# Altium schematic sheet Sheet_1_2020-07-27_09-10-22.schdoc
size 313 x 206 mm
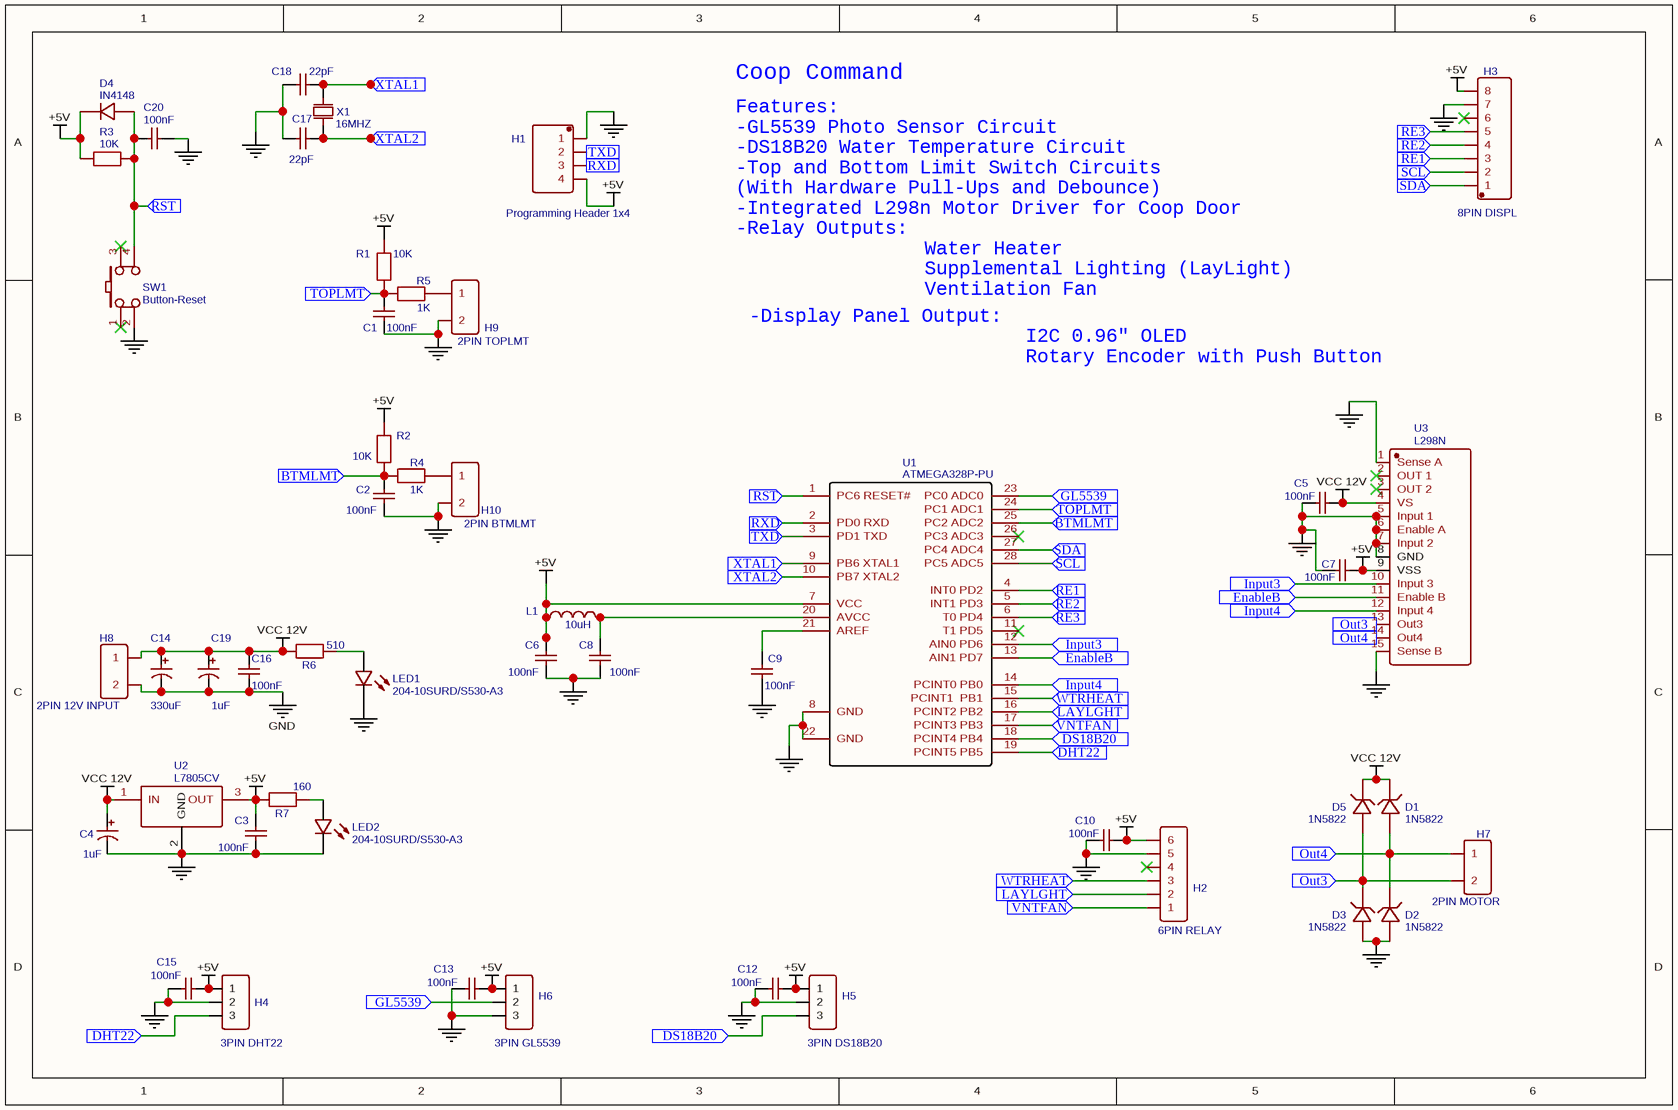
[diagram p0: Sheet_1_2020-07-27_09-10-22.schdoc]

## Parts
C1  100nF  [CAP-TH_L5.0-W2.5-P2.54-D0.7]
C2  100nF  [CAP-TH_L5.0-W2.5-P2.54-D0.7]
C3  100nF  [CAP-TH_L5.0-W2.5-P2.54-D0.7]
C4  1uF  [CAP-TH_BD4.0-P1.50-D0.8-FD]
C5  100nF  [CAP-TH_L5.0-W2.5-P2.54-D0.7]
C6  100nF  [CAP-TH_L5.0-W2.5-P2.54-D0.7]
C7  100nF  [CAP-TH_L5.0-W2.5-P2.54-D0.7]
C8  100nF  [CAP-TH_L5.0-W2.5-P2.54-D0.7]
C9  100nF  [CAP-TH_L5.0-W2.5-P2.54-D0.7]
C10  100nF  [CAP-TH_L5.0-W2.5-P2.54-D0.7]
C12  100nF  [CAP-TH_L5.0-W2.5-P2.54-D0.7]
C13  100nF  [CAP-TH_L5.0-W2.5-P2.54-D0.7]
C14  330uF  [CAP-TH_BD10.0-P5.00-D1.0-FD]
C15  100nF  [CAP-TH_L5.0-W2.5-P2.54-D0.7]
C16  100nF  [CAP-TH_L5.0-W2.5-P2.54-D0.7]
C17  22pF  [CAP-TH_L3.5-W3.0-P2.54-D0.8]
C18  22pF  [CAP-TH_L3.5-W3.0-P2.54-D0.8]
C19  1uF  [CAP-TH_BD4.0-P1.50-D0.8-FD]
C20  100nF  [CAP-TH_L5.0-W2.5-P2.54-D0.7]
D1  1N5822  [DO-27-BD3.5-L8.6-P12.6-D1.3-R-RD]
D2  1N5822  [DO-27-BD3.5-L8.6-P12.6-D1.3-R-RD]
D3  1N5822  [DO-27-BD3.5-L8.6-P12.6-D1.3-R-RD]
D4  IN4148  [DO-35_BD2.0-L4.2-P8.20-D0.5-RD]
D5  1N5822  [DO-27-BD3.5-L8.6-P12.6-D1.3-R-RD]
H1  Programming Header 1x4  [HDR-TH_4P-P2.54-V]
H2  6PIN RELAY  [HDR-TH_6P-P2.54-V]
H3  8PIN DISPL  [HDR-TH_8P-P2.54-V-M]
H4  3PIN DHT22  [HDR-TH_3P-P2.54-V]
H5  3PIN DS18B20  [HDR-TH_3P-P2.54-V]
H6  3PIN GL5539  [HDR-TH_3P-P2.54-V]
H7  2PIN MOTOR  [HDR-TH_2P-P2.54-V]
H8  2PIN 12V INPUT  [HDR-TH_2P-P2.54-V]
H9  2PIN TOPLMT  [HDR-TH_2P-P2.54-V]
H10  2PIN BTMLMT  [HDR-TH_2P-P2.54-V]
L1  10uH  [IND-TH_BD2.8-L7.0-P11.00-D0.5]
LED1  204-10SURD/S530-A3  [LED-TH_BD3.0-P2.54-FD]
LED2  204-10SURD/S530-A3  [LED-TH_BD3.0-P2.54-FD]
R1  10K  [RES-TH_BD2.4-L6.3-P10.30-D0.6]
R2  10K  [RES-TH_BD2.4-L6.3-P10.30-D0.6]
R3  10K  [RES-TH_BD2.4-L6.3-P10.30-D0.6]
R4  1K  [RES-TH_BD2.4-L6.3-P10.30-D0.6]
R5  1K  [RES-TH_BD2.4-L6.3-P10.30-D0.6]
R6  510  [RES-TH_BD2.4-L6.3-P10.30-D0.6]
R7  160  [RES-TH_BD2.4-L6.3-P10.30-D0.6]
SW1  Button-Reset  [SW-TH_4PIN-L6.00-W6.00]
U1  ATMEGA328P-PU  [DIP-28_L34.6-W7.3-P2.54-LS10.2-BL]
U2  L7805CV  [TO-220-3_L10.0-W4.5-P2.54-L]
U3  L298N  [MULTIWATT-15_L19.6-W5.0-P1.27-L]
X1  16MHZ  [HC-49S_L11.0-W4.4-P4.88]

## Ports
BTMLMT (in), DHT22 (in), DS18B20 (in), EnableB (in), GL5539 (in), Input3 (in), Input4 (in), LAYLGHT (in), Out3 (in), Out4 (in), RE1 (in), RE2 (in), RE3 (in), RST (in), RXD (in), SCL (in), SDA (in), TOPLMT (in), TXD (in), VNTFAN (in), WTRHEAT (in), XTAL1 (in), XTAL2 (in)

## Nets
+5V: C3.1 C6.1 C7.2 C10.2 C12.2 C13.2 C15.2 D4.1 H1.4 H2.6 H3.8 H4.1 H5.1 H6.1 L1.1 R1.2 R2.2 R3.2 R7.1 U1.7(VCC) U2.3(OUT) U3.9(VSS)
GND: C1.2 C2.2 C3.2 C4.2 C5.1 C6.2 C7.1 C8.2 C9.2 C10.1 C12.1 C13.1 C14.2 C15.1 C16.2 C17.1 C18.1 C19.2 C20.2 D2.2(A) D3.2(A) H1.1 H2.5 H3.7 H4.2 H5.2 H6.3 H8.2 H9.2 H10.2 LED1.2(K) LED2.2(K) SW1.2 U1.8(GND) U1.22(GND) U2.2(GND) U3.1(Sense_A) U3.5(Input_1) U3.6(Enable_A) U3.7(Input_2) U3.8(GND) U3.15(Sense_B)
VCC 12V: C4.1 C5.2 C14.1 C16.1 C19.1 D1.1(C) D5.1(C) H8.1 R6.1 U2.1(IN) U3.4(VS)
BTMLMT: C2.1 R2.1 R4.1 U1.25(PC2_ADC2) ; port BTMLMT
DHT22: H4.3 U1.19(PCINT5_PB5) ; port DHT22
DS18B20: H5.3 U1.18(PCINT4_PB4) ; port DS18B20
EnableB: U1.13(AIN1_PD7) U3.11(Enable_B) ; port EnableB
GL5539: H6.2 U1.23(PC0_ADC0) ; port GL5539
Input3: U1.12(AIN0_PD6) U3.10(Input_3) ; port Input3
Input4: U1.14(PCINT0_PB0) U3.12(Input_4) ; port Input4
LAYLGHT: H2.2 U1.16(PCINT2_PB2) ; port LAYLGHT
Out3: D3.1(C) D5.2(A) H7.2 U3.13(Out3) ; port Out3
Out4: D1.2(A) D2.1(C) H7.1 U3.14(Out4) ; port Out4
RE1: H3.3 U1.4(INT0_PD2) ; port RE1
RE2: H3.4 U1.5(INT1_PD3) ; port RE2
RE3: H3.5 U1.6(T0_PD4) ; port RE3
RST: C20.1 D4.2 R3.1 SW1.4 U1.1(PC6_RESET#) ; port RST
RXD: H1.3 U1.2(PD0_RXD) ; port RXD
SCL: H3.2 U1.28(PC5_ADC5) ; port SCL
SDA: H3.1 U1.27(PC4_ADC4) ; port SDA
TOPLMT: C1.1 R1.1 R5.1 U1.24(PC1_ADC1) ; port TOPLMT
TXD: H1.2 U1.3(PD1_TXD) ; port TXD
VNTFAN: H2.1 U1.17(PCINT3_PB3) ; port VNTFAN
WTRHEAT: H2.3 U1.15(PCINT1__PB1) ; port WTRHEAT
XTAL1: C18.2 U1.9(PB6_XTAL1) X1.1(OSC1) ; port XTAL1
XTAL2: C17.2 U1.10(PB7_XTAL2) X1.2(OSC2) ; port XTAL2
NetC8_1: C8.1 L1.2 U1.20(AVCC)
NetC9_1: C9.1 U1.21(AREF)
NetH9_1: H9.1 R5.2
NetH10_1: H10.1 R4.2
NetLED1_1: LED1.1(A) R6.2
NetLED2_1: LED2.1(A) R7.2

Not connected (* = marked no-connect by the designer): H2 4*; H3 6*; SW1 1* 3*; U1 11(T1_PD5)* 26(PC3_ADC3)*; U3 2(OUT_1)* 3(OUT_2)*

## Notes on the sheet
- Coop Command
- Features:
- -GL5539 Photo Sensor Circuit
- -DS18B20 Water Temperature Circuit
- -Top and Bottom Limit Switch Circuits
- (With Hardware Pull-Ups and Debounce)
- -Integrated L298n Motor Driver for Coop Door
- -Relay Outputs:
- Water Heater
- -Display Panel Output:
- Supplemental Lighting (LayLight)
- Ventilation Fan
- I2C 0.96" OLED
- Rotary Encoder with Push Button

## Library data of the parts
C1-C3 C5-C10 C12 C13 C15 C16 C20 = 100nF: BOM_Manufacturer: ReliaPro; BOM_Manufacturer Part: CS1F5.6Y5V1A104Z; nameAlias: Value; BOM_Supplier: LCSC; BOM_Supplier Part: C9306; spicePre: C; spiceSymbolName: CS1F5.6Y5V1A104Z
C4 C19 = 1uF: BOM_Manufacturer: ValuePro; BOM_Manufacturer Part: 1uF 50V 4*5; nameAlias: Capacitance; BOM_Supplier: LCSC; BOM_Supplier Part: C47848; spicePre: C; spiceSymbolName: 1uF 50V 4*5
C14 = 330uF: BOM_Manufacturer: ValuePro; BOM_Manufacturer Part: 330uF 50V 10*17; nameAlias: Capacitance; BOM_Supplier: LCSC; BOM_Supplier Part: C45107; spicePre: C; spiceSymbolName: 330uF 50V 10*17
C17 C18 = 22pF: BOM_Manufacturer: ReliaPro; BOM_Manufacturer Part: 22pf/50V 10%; nameAlias: Capacitance; BOM_Supplier: LCSC; BOM_Supplier Part: C9316; spicePre: C; spiceSymbolName: 22pf/50V 10%
D1-D3 D5 = 1N5822: BOM_Manufacturer: LGE; Contributor: LCSC; BOM_Supplier: LCSC; BOM_Supplier Part: C402220; BOM_Manufacturer Part: 1N5822; spicePre: D; spiceSymbolName: 1N5822_C402220
D4 = IN4148: BOM_Manufacturer: Semtech; Contributor: LCSC; BOM_Supplier: LCSC; BOM_Supplier Part: C14538; BOM_Manufacturer Part: IN4148; spicePre: D; spiceSymbolName: IN4148
H1 = Programming Header 1x4: BOM_Manufacturer: Ckmtw; BOM_Manufacturer Part: 210S-1*4P L=11.6MMGold-plated black; Contributor: LCSC; Package Display: No; BOM_Supplier: LCSC; BOM_Supplier Part: C124378; spicePre: H; spiceSymbolName: Header-Male-2.54_1x4
H2 = 6PIN RELAY: BOM_Manufacturer: BOOMELE; BOM_Manufacturer Part: Header-Male-2.54_1x6; BOM_Supplier: LCSC; BOM_Supplier Part: C37208; spicePre: H; spiceSymbolName: Header-Male-2.54_1x6
H3 = 8PIN DISPL: BOM_Manufacturer: Ckmtw; BOM_Manufacturer Part: 210S-1*8P L=11.6MMGold-plated black; Contributor: LCSC; BOM_Supplier: LCSC; BOM_Supplier Part: C124381; spicePre: H; spiceSymbolName: Header-Male-2.54_1x8
H4 = 3PIN DHT22: BOM_Manufacturer: BOOMELE; BOM_Manufacturer Part: Header2.54mm 1*3P; BOM_Supplier: LCSC; image: //image.lceda.cn/szlcsc/C49257.jpg; BOM_Supplier Part: C49257; spicePre: H; spiceSymbolName: Header-Male-2.54_1x3
H5 = 3PIN DS18B20: BOM_Manufacturer: BOOMELE; BOM_Manufacturer Part: Header2.54mm 1*3P; BOM_Supplier: LCSC; image: //image.lceda.cn/szlcsc/C49257.jpg; BOM_Supplier Part: C49257; spicePre: H; spiceSymbolName: Header-Male-2.54_1x3
H6 = 3PIN GL5539: BOM_Manufacturer: BOOMELE; BOM_Manufacturer Part: Header2.54mm 1*3P; BOM_Supplier: LCSC; image: //image.lceda.cn/szlcsc/C49257.jpg; BOM_Supplier Part: C49257; spicePre: H; spiceSymbolName: Header-Male-2.54_1x3
H7 = 2PIN MOTOR: BOM_Manufacturer: TE Connectivity; BOM_Manufacturer Part: 826629-2; BOM_Supplier: LCSC; image: //image.lceda.cn/szlcsc/C86471.jpg; BOM_Supplier Part: C86471; spicePre: H; spiceSymbolName: Header-Male-2.54_1x2
H8 = 2PIN 12V INPUT: BOM_Manufacturer: TE Connectivity; BOM_Manufacturer Part: 826629-2; BOM_Supplier: LCSC; image: //image.lceda.cn/szlcsc/C86471.jpg; BOM_Supplier Part: C86471; spicePre: H; spiceSymbolName: Header-Male-2.54_1x2
H9 = 2PIN TOPLMT: BOM_Manufacturer: TE Connectivity; BOM_Manufacturer Part: 826629-2; BOM_Supplier: LCSC; image: //image.lceda.cn/szlcsc/C86471.jpg; BOM_Supplier Part: C86471; spicePre: H; spiceSymbolName: Header-Male-2.54_1x2
H10 = 2PIN BTMLMT: BOM_Manufacturer: TE Connectivity; BOM_Manufacturer Part: 826629-2; BOM_Supplier: LCSC; image: //image.lceda.cn/szlcsc/C86471.jpg; BOM_Supplier Part: C86471; spicePre: H; spiceSymbolName: Header-Male-2.54_1x2
L1 = 10uH: BOM_Manufacturer: FH; BOM_Manufacturer Part: LGA0307-100KP52E; nameAlias: Inductance; BOM_Supplier: LCSC; BOM_Supplier Part: C84773; spicePre: L; spiceSymbolName: LGA0307-100KP52E
LED1 LED2 = 204-10SURD/S530-A3: BOM_Manufacturer: EVERLIGHT; BOM_Supplier: LCSC; BOM_Manufacturer Part: 204-10SURD/S530-A3; BOM_Supplier Part: C99772; spicePre: L; spiceSymbolName: 204-10SURD/S530-A3
R1-R3 = 10K: BOM_Manufacturer: TyoHM; BOM_Manufacturer Part: RN 1/4W 10K F T/B A1; nameAlias: Resistance (Ohms); Contributor: LCSC; BOM_Supplier: LCSC; BOM_Supplier Part: C410695; spicePre: R; spiceSymbolName: RN 1/4W 10K F T/B A1
R4 R5 = 1K: BOM_Manufacturer: TyoHM; BOM_Manufacturer Part: RN 1/4W 1K F T/B A1; nameAlias: Resistance (Ohms); Contributor: LCSC; BOM_Supplier: LCSC; BOM_Supplier Part: C410696; spicePre: R; spiceSymbolName: RN 1/4W 1K F T/B A1
R6 = 510: BOM_Manufacturer: TyoHM; BOM_Manufacturer Part: RN 1/2WS 510R F T/B A1; nameAlias: Resistance (Ohms); Contributor: LCSC; BOM_Supplier: LCSC; BOM_Supplier Part: C433511; spicePre: R; spiceSymbolName: RN 1/2WS 510R F T/B A1
R7 = 160: BOM_Manufacturer: TyoHM; BOM_Manufacturer Part: RN 1/4W 160R F T/B A1; nameAlias: Resistance (Ohms); Contributor: LCSC; BOM_Supplier: LCSC; BOM_Supplier Part: C410672; spicePre: R; spiceSymbolName: RN 1/4W 160R F T/B A1
SW1 = Button-Reset: BOM_Manufacturer: BBJ; BOM_Manufacturer Part: Switch,6*6*6Plastic head,260G, 0.25mm,Straight line; BOM_Supplier Part: C71836; BOM_Supplier: LCSC; spicePre: S; spiceSymbolName: Button-6x6x6mm
U1 = ATMEGA328P-PU: BOM_Manufacturer: MICROCHIP; sourceId: Oic6oiASL; Contributor: LCSC; timeStamp: 1451725987; BOM_Supplier: LCSC; BOM_Manufacturer Part: ATMEGA328P-PU; image: //image.lceda.cn/szlcsc/C33901.jpg; BOM_Supplier Part: C33901; spicePre: U; spiceSymbolName: ATMEGA328P-PU
U2 = L7805CV: BOM_Manufacturer: STMicroelectronics; BOM_Supplier: LCSC; BOM_Manufacturer Part: L7805CV; BOM_Supplier Part: C111887; spicePre: U; spiceSymbolName: L7805CV
U3 = L298N: BOM_Manufacturer: HGSEMI; Contributor: LCSC; Package Display: No; BOM_Supplier: LCSC; BOM_Supplier Part: C434589; BOM_Manufacturer Part: L298N; spicePre: U; spiceSymbolName: L298N
X1 = 16MHZ: BOM_Manufacturer: XTY; BOM_Manufacturer Part: 5S0-1600A1620-00; nameAlias: Value; Contributor: LCSC; BOM_Supplier: LCSC; BOM_Supplier Part: C389708; spicePre: X; spiceSymbolName: 5S0-1600A1620-00